# Altium schematic sheet DAC.SchDoc
size A4
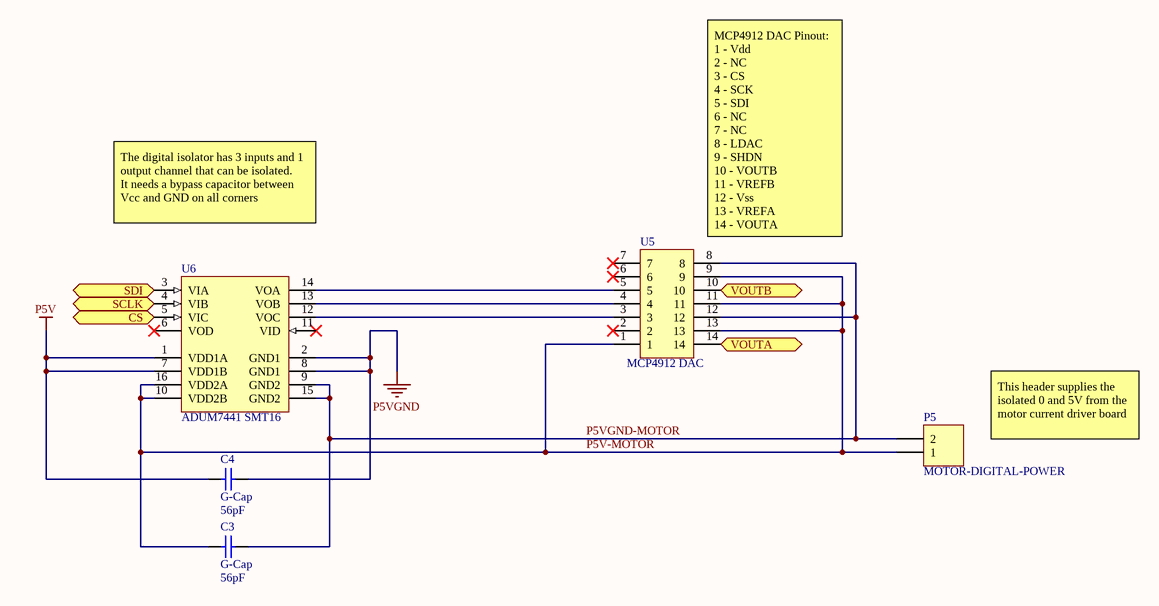
[diagram p0: DAC.SchDoc]

## Parts
C3  G-Cap  value 56pF  [Cap2.54mm_LGE1.0]
C4  G-Cap  value 56pF  [Cap2.54mm_LGE1.0]
P5  MOTOR-DIGITAL-POWER  [HDR1X2_LGE1.0]
U5  MCP4912 DAC  [ISDIP14_LGE1.0]
U6  ADUM7441 SMT16  [ADUM7441]

## Ports
CS (in), SCLK (in), SDI (in), VOUTA (out), VOUTB (out)

## Nets
P5V: C4.1 U6.1(VDD1A) U6.7(VDD1B)
P5VGND: C4.2 U6.2(GND1) U6.8(GND1)
CS: U6.5(VIC) ; port CS
P5V-MOTOR: C3.1 P5.1 U5.1 U5.9 U5.11 U5.13 U6.10(VDD2B) U6.16(VDD2A)
P5VGND-MOTOR: C3.2 P5.2 U5.8 U5.12 U6.9(GND2) U6.15(GND2)
SCLK: U6.4(VIB) ; port SCLK
SDI: U6.3(VIA) ; port SDI
VOUTA: U5.14 ; port VOUTA
VOUTB: U5.10 ; port VOUTB
NetU5_3: U5.3 U6.12(VOC)
NetU5_4: U5.4 U6.13(VOB)
NetU5_5: U5.5 U6.14(VOA)

Not connected (* = marked no-connect by the designer): U5 2* 6* 7*; U6 6(VOD)* 11(VID)*

## Notes on the sheet
- The digital isolator has 3 inputs and 1 output channel that can be isolated.
  It needs a bypass capacitor between Vcc and GND on all corners
- (near U5) MCP4912 DAC Pinout:
  1 - Vdd
  2 - NC
  3 - CS
  4 - SCK
  5 - SDI
  6 - NC
  7 - NC
  8 - LDAC
  9 - SHDN
  10 - VOUTB
  11 - VREFB
  12 - Vss
  13 - VREFA
  14 - VOUTA
- This header supplies the isolated 0 and 5V from the motor current driver board

## Library data of the parts
C3 C4 = G-Cap: capacitor (specify value); Published: 8-Jun-2000; LatestRevisionDate: 17-Jul-2002; LatestRevisionNote: Re-released for DXP Platform.; PackageReference: RAD-0.3; Publisher: Altium Limited
P5 = C-Hdr1x2: Header, 2-Pin; LatestRevisionDate: 17-Jul-2002; LatestRevisionNote: Re-released for DXP Platform.; Publisher: Altium Limited
U5 = G-DIP14: DAC; Published: 13-Oct-2000; LatestRevisionDate: 17-Jul-2002; LatestRevisionNote: Re-released for DXP Platform.; DatasheetVersion: 19-Mar-1998; PackageVersion: Oct-1998; PackageReference: ISDIP28; Publisher: Altium Limited; PackageDescription: DIP; 28 Rectangular Pins; Row Space 15.24 mm; Pitch 2.54 mm; ComponentLink1Description: Manufacturer Link; ComponentLink1URL: http://www.maxim-ic.com/; ComponentLink2Description: Datasheet; ComponentLink2URL: http://pdfserv.maxim-ic.com/en/ds/DS1213B.pdf; ComponentLink3Description: Discontinuation Notice; ComponentLink3URL: http://www.maxim-ic.com/qa/pdfs/non-obsolescence-letter.pdf
U6 = ADUM7441CRQZ: Quad Channel Digital Isolator, 1 KV rms Insulation Rating, 25 Mbps Data Rate, 50 ns Delay, Industrial, 16-pin SOP (RQ-16), Tube; Manufacturer: Analog Devices; Insulation Rating (kVrms): 1; Max Data Rate: 25Mbps; DatasheetVersion: Rev. C; PackageVersion: Aug-05; PackageReference: RQ-16; PackageDescription: 16-Pin Shrink Small Outline Package, Body 4.9 x 3.9 mm, Pitch 0.64 mm; Supplier 1: Digi-Key; Supplier Part Number 1: ADUM7441CRQZ-ND; Supplier 2: Farnell; Supplier Part Number 2: 2377154; Supplier 3: Farnell; Supplier Part Number 3: 2192232; Supplier 4: Mouser; Supplier Part Number 4: 584-ADUM7441CRQZ; Max Operating Temp (degreesC): 105; Mounting Technology: Surface Mount; Code_JEDEC: MO-137-AB; PartNumber: ADUM7441CRQZ; ComponentLink1Description: Manufacturer URL; ComponentLink1URL: http://www.analog.com/en/index.html; ComponentLink2Description: Datasheet; ComponentLink2URL: http://www.analog.com/static/imported-files/data_sheets/ADuM7440_7441_7442.pdf; ComponentLink3Description: Package Specification; ComponentLink3URL: http://www.analog.com/static/imported-files/packages/5595549651201762937RQ_16.pdf; ComponentLink4Description: URL Link1; ComponentLink4URL: Product URL:http://www.analog.com/en/interface-isolation/digital-isolators/adum7441/products/product.html